# Altium project multimeter.prjpcb
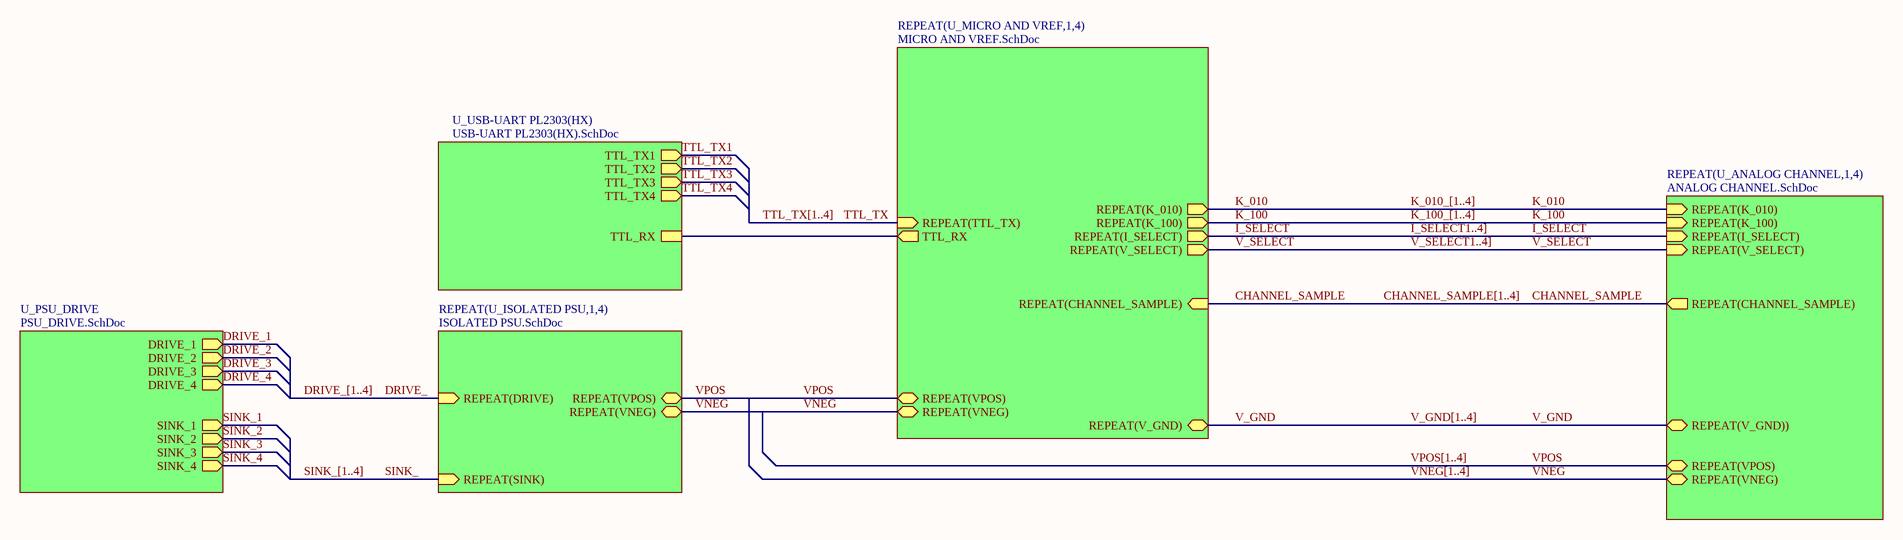
[diagram p0: Multi2Meter.SchDoc]
4 sheets, 212 parts. Net scope: hierarchical (ports join the sheet entries above them; power ports are global).
Board files: m2m v00.PcbDoc, m2m V00 End Plate 00.PcbDoc, m2m V00 End Plate 01.PcbDoc, SEEED ORDER METER (BOOTSTRAP).PcbDoc
Sheets:
  Multi2Meter.SchDoc
    U_ANALOG CHANNEL1 = ANALOG CHANNEL.SchDoc
    U_ANALOG CHANNEL2 = ANALOG CHANNEL.SchDoc
    U_ANALOG CHANNEL3 = ANALOG CHANNEL.SchDoc
    U_ANALOG CHANNEL4 = ANALOG CHANNEL.SchDoc
    U_MICRO AND VREF1 = MICRO AND VREF.SchDoc
    U_MICRO AND VREF2 = MICRO AND VREF.SchDoc
    U_MICRO AND VREF3 = MICRO AND VREF.SchDoc
    U_MICRO AND VREF4 = MICRO AND VREF.SchDoc
    U_ISOLATED PSU1 = ISOLATED PSU.SchDoc
    U_ISOLATED PSU2 = ISOLATED PSU.SchDoc
    U_ISOLATED PSU3 = ISOLATED PSU.SchDoc
    U_ISOLATED PSU4 = ISOLATED PSU.SchDoc

## Sheet Multi2Meter.SchDoc
size A3

### Sub-sheets
REPEAT(U_ANALOG CHANNEL,1,4) = ANALOG CHANNEL.SchDoc: REPEAT(K_010) (in), REPEAT(K_100) (in), REPEAT(I_SELECT) (in), REPEAT(V_SELECT) (in), REPEAT(CHANNEL_SAMPLE) (out), REPEAT(V_GND)) (bidir), REPEAT(VPOS) (bidir), REPEAT(VNEG) (bidir)
REPEAT(U_ISOLATED PSU,1,4) = ISOLATED PSU.SchDoc: REPEAT(DRIVE) (in), REPEAT(SINK) (in), REPEAT(VPOS) (bidir), REPEAT(VNEG) (bidir)
REPEAT(U_MICRO AND VREF,1,4) = MICRO AND VREF.SchDoc: REPEAT(TTL_TX) (in), TTL_RX, REPEAT(K_010) (out), REPEAT(K_100) (out), REPEAT(I_SELECT) (out), REPEAT(V_SELECT) (out), REPEAT(CHANNEL_SAMPLE) (in), REPEAT(V_GND) (bidir), REPEAT(VPOS) (bidir), REPEAT(VNEG) (bidir)
U_PSU_DRIVE = PSU_DRIVE.SchDoc (file not in this document): DRIVE_1 (out), SINK_1 (out), DRIVE_2 (out), SINK_2 (out), DRIVE_3 (out), SINK_3 (out), DRIVE_4 (out), SINK_4 (out)
U_USB-UART PL2303(HX) = USB-UART PL2303(HX).SchDoc (file not in this document): TTL_TX1 (out), TTL_TX2 (out), TTL_TX3 (out), TTL_TX4 (out), TTL_RX

### Nets
CHANNEL_SAMPLE: sheet REPEAT(U_ANALOG CHANNEL,1,4)/REPEAT(CHANNEL_SAMPLE), sheet REPEAT(U_MICRO AND VREF,1,4)/REPEAT(CHANNEL_SAMPLE)
DRIVE_: sheet REPEAT(U_ISOLATED PSU,1,4)/REPEAT(DRIVE)
I_SELECT: sheet REPEAT(U_ANALOG CHANNEL,1,4)/REPEAT(I_SELECT), sheet REPEAT(U_MICRO AND VREF,1,4)/REPEAT(I_SELECT)
K_010: sheet REPEAT(U_ANALOG CHANNEL,1,4)/REPEAT(K_010), sheet REPEAT(U_MICRO AND VREF,1,4)/REPEAT(K_010)
K_100: sheet REPEAT(U_ANALOG CHANNEL,1,4)/REPEAT(K_100), sheet REPEAT(U_MICRO AND VREF,1,4)/REPEAT(K_100)
SINK_: sheet REPEAT(U_ISOLATED PSU,1,4)/REPEAT(SINK)
TTL_TX: sheet REPEAT(U_MICRO AND VREF,1,4)/REPEAT(TTL_TX)
V_GND: sheet REPEAT(U_ANALOG CHANNEL,1,4)/REPEAT(V_GND)), sheet REPEAT(U_MICRO AND VREF,1,4)/REPEAT(V_GND)
V_SELECT: sheet REPEAT(U_ANALOG CHANNEL,1,4)/REPEAT(V_SELECT), sheet REPEAT(U_MICRO AND VREF,1,4)/REPEAT(V_SELECT)
VNEG: sheet REPEAT(U_ANALOG CHANNEL,1,4)/REPEAT(VNEG), sheet REPEAT(U_MICRO AND VREF,1,4)/REPEAT(VNEG), sheet REPEAT(U_ISOLATED PSU,1,4)/REPEAT(VNEG)
VPOS: sheet REPEAT(U_ANALOG CHANNEL,1,4)/REPEAT(VPOS), sheet REPEAT(U_MICRO AND VREF,1,4)/REPEAT(VPOS), sheet REPEAT(U_ISOLATED PSU,1,4)/REPEAT(VPOS)
NetR21A_2: sheet REPEAT(U_MICRO AND VREF,1,4)/TTL_RX, sheet U_USB-UART PL2303(HX)/TTL_RX

### Buses and harness runs
bus CHANNEL_SAMPLE[1..4]
bus DRIVE_[1..4]
bus I_SELECT1..4]
bus K_010_[1..4]
bus K_100_[1..4]
bus SINK_[1..4]
bus TTL_TX[1..4]
bus V_GND[1..4]
bus V_SELECT1..4]
bus VNEG[1..4]
bus VPOS[1..4]

## Sheet ANALOG CHANNEL.SchDoc
size A4; DrawnBy: SML; Revision: 0; SheetNumber: 2; Title2: Title2
Used 4 times, as channels U_ANALOG CHANNEL1, U_ANALOG CHANNEL2, U_ANALOG CHANNEL3, U_ANALOG CHANNEL4. Parts and nets are listed once, with the designators drawn on the sheet.
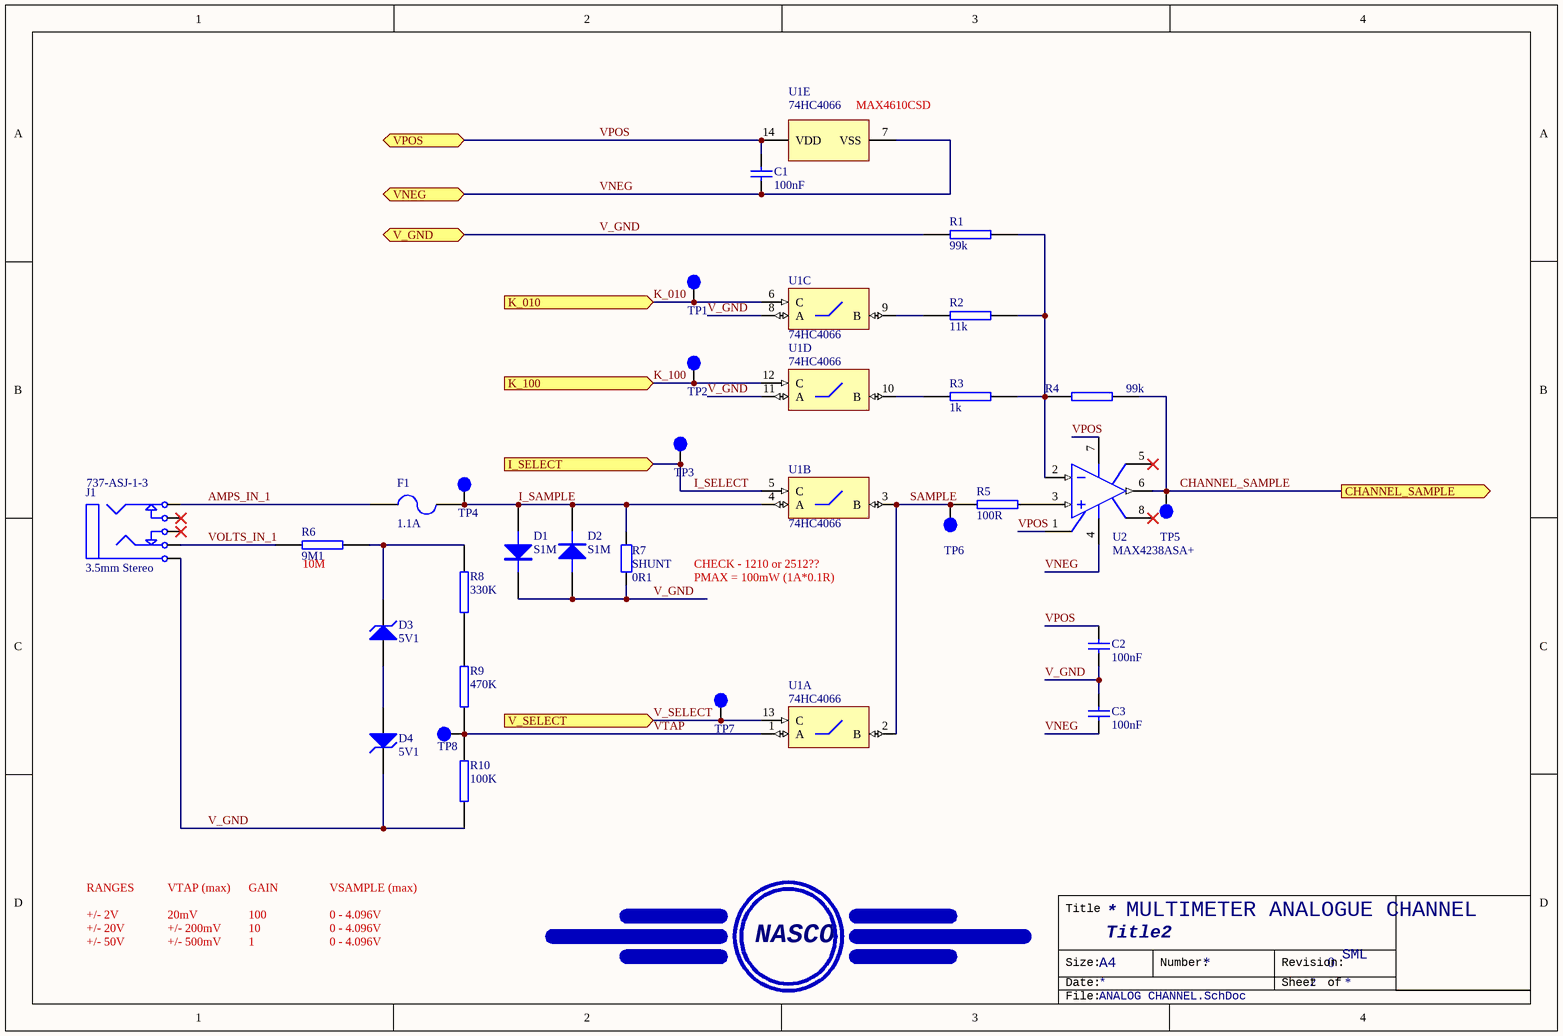
[diagram p1: ANALOG CHANNEL.SchDoc]

### Parts
?  (no value)  (no BOM)
C1  100nF  [CAP (3D) - 0603]
C2  100nF  [CAP (3D) - 0603]
C3  100nF  [CAP (3D) - 0603]
D1  S1M  [DO-214AC]
D2  S1M  [DO-214AC]
D3  5V1  [SOT23-3L]
D4  5V1  [SOT23-3L]
F1  1.1A  [LITTELFUSE 1210]
J1  3.5mm Stereo  Supplier Part Number 1: 737-ASJ-1-3  [3.5MM pcb mouNt]
R1  99k  [RES (3D) - 0603]
R2  11k  [RES (3D) - 0603]
R3  1k  [RES (3D) - 0603]
R4  99k  [RES (3D) - 0603]
R5  100R  [RES (3D) - 0603]
R6  9M1  [RES (3D) - 0603]
R7  SHUNT  value 0R1  [RES (3D) - 1210]
R8  330K  [RES (3D) - 0603]
R9  470K  [RES (3D) - 0603]
R10  100K  [RES (3D) - 0603]
TP1  TestPoint  [TP]  (value not drawn)
TP2  TestPoint  [TP]  (value not drawn)
TP3  TestPoint  [TP]  (value not drawn)
TP4  TestPoint  [TP]  (value not drawn)
TP5  TestPoint  [TP]  (value not drawn)
TP6  TestPoint  [TP]  (value not drawn)
TP7  TestPoint  [TP]  (value not drawn)
TP8  TestPoint  [TP]  (value not drawn)
U1  74HC4066  [DIP-16]  (parts A,B,C,D,E of 5)
U2  MAX4238ASA+  [SO-8]

### Ports
CHANNEL_SAMPLE (out), I_SELECT (in), K_010 (in), K_100 (in), V_GND (bidir), V_SELECT (in), VNEG (bidir), VPOS (bidir)

### Nets
AMPS_IN_1: F1.1 J1.5
CHANNEL_SAMPLE: R4.2 TP5.1 U2.6(OUT) ; port CHANNEL_SAMPLE
I_SAMPLE: D1.1(A) D2.2(K) F1.2 R7.2 TP4.1 U1.4(A)
I_SELECT: TP3.1 U1.5(C) ; port I_SELECT
K_010: TP1.1 U1.6(C) ; port K_010
K_100: TP2.1 U1.12(C) ; port K_100
SAMPLE: R5.1 TP6.1 U1.2(B) U1.3(B)
V_GND: C2.1 C3.2 D1.2(K) D2.1(A) D4.2(K) J1.1 R1.1 R7.1 R10.2 U1.8(A) U1.11(A) ; port V_GND
V_SELECT: TP7.1 U1.13(C) ; port V_SELECT
VNEG: C1.1 C3.1 U1.7(VSS) U2.4(VEE) ; port VNEG
VOLTS_IN_1: J1.2 R6.1
VPOS: C1.2 C2.2 U1.14(VDD) U2.1(NULL) U2.7(VCC) ; port VPOS
VTAP: R9.2 R10.1 TP8.1 U1.1(A)
NetD3_1: D3.1(A) D4.1(A)
NetD3_2: D3.2(K) R6.2 R8.1
NetR1_2: R1.2 R2.2 R3.2 R4.1 U2.2(IN-)
NetR2_1: R2.1 U1.9(B)
NetR3_1: R3.1 U1.10(B)
NetR5_2: R5.2 U2.3(IN+)
NetR8_2: R8.2 R9.1

Not connected (* = marked no-connect by the designer): J1 3* 4*; U2 5(NULL)* 8(NC)*

### Channels
U_ANALOG CHANNEL1: designators end in A; ports CHANNEL_SAMPLE=CHANNEL_SAMPLE I_SELECT=I_SELECT K_010=K_010 K_100=K_100 V_GND=V_GND_U_ANALOG CHANNEL1 V_SELECT=V_SELECT VNEG=VNEG VPOS=VPOS
U_ANALOG CHANNEL2: designators end in B; ports CHANNEL_SAMPLE=CHANNEL_SAMPLE I_SELECT=I_SELECT K_010=K_010 K_100=K_100 V_GND=V_GND_U_ANALOG CHANNEL2 V_SELECT=V_SELECT VNEG=VNEG VPOS=VPOS
U_ANALOG CHANNEL3: designators end in C; ports CHANNEL_SAMPLE=CHANNEL_SAMPLE I_SELECT=I_SELECT K_010=K_010 K_100=K_100 V_GND=V_GND_U_ANALOG CHANNEL3 V_SELECT=V_SELECT VNEG=VNEG VPOS=VPOS
U_ANALOG CHANNEL4: designators end in D; ports CHANNEL_SAMPLE=CHANNEL_SAMPLE I_SELECT=I_SELECT K_010=K_010 K_100=K_100 V_GND=V_GND_U_ANALOG CHANNEL4 V_SELECT=V_SELECT VNEG=VNEG VPOS=VPOS

### Notes on the sheet
- (near U1) MAX4610CSD
- (near R6) 10M
- CHECK - 1210 or 2512??
- PMAX = 100mW (1A*0.1R)
- RANGES
- +/- 2V
- VTAP (max)
- 20mV
- GAIN
- 100
- VSAMPLE (max)
- 0 - 4.096V
- MULTIMETER ANALOGUE CHANNEL
- +/- 20V
- +/- 50V
- +/- 200mV
- +/- 500mV
- 10
- 1
- Title
- NASCO
- Size:
- Date:
- A4
- Number:
- Revision:
- Sheet
- of
- File:

### Library data of the parts
? = NASCO_LOGO: LOGO
C1-C3 = Cap: Capacitor; Value: 100nF; Supplier 1: Mouser; Supplier 2: Digi-Key; Supplier Part Number 1: 603-C0603ZRY5V9BB104; Supplier Part Number 2: 311-1343-2-ND
D1 D2 = DIODE: DIODE, POWER; Manufacturer: TAIWAN SEMI; Mouser Part no.: 821-S1M; Manufacturer Part No.: S1M; value: S1M; Web link: http://au.mouser.com/ProductDetail/Taiwan-Semiconductor/S1M/?qs=sGAEpiMZZMtEwUVCuofpuOlSmRjzJonf%252bmrIm0%252bGbjE%3d
D3 D4 = D Zener: Zener Diode; pin to pad: 2>3; Value: 5V1; Supplier 1: Mouser; Supplier Part Number 1: 625-BZX84C5V1-V; Supplier 2: Digi-Key; Supplier Part Number 2: BZX84C5V1-V-GS08CT-ND
F1 = Fuse 2: Fuse; Manufacturer: Littlefuse; Manufacturer Part No.: 1206L110THYR; Revision: July-2002: Re-released for DXP Platform.; Mouser Part No.: 576-1206L110THYR; Value: 1.1A; Web link: http://au.mouser.com/ProductDetail/Littelfuse/1206L110THYR/?qs=sGAEpiMZZMu7EFbsM1w0ne5Dyqsx7igC3NaPmo8Qtk8%3d
J1 = Phonejack Stereo SW: 3-Conductor Jack with 2 break contacts (normals) and 2 auxiliary make contacts; Altronics Part no.: P0073; Manufacturer: Neutrik; Manufacturer Part No.: NMJ6HFD2; Mouser Part no.: 550-20301; Web link: http://au.mouser.com/ProductDetail/Neutrik/NMJ6HFD2/?qs=y5MlCMoPWsng3r9W7xlRqw%3d%3d; Supplier 1: Mouser
R1-R5 = RES SMD 0603: RESISTOR SMD 0603
  R1 R4: value: 99k
  R2: value: 11k
  R3: value: 1k
  R5: value: 100R
R6 = RES SMD 0603 10k: RESISTOR SMD 0603 10k; Manufacturer: Vishay/Dale; Manufacturer Part No.: CRCW06038M06FKEA; Mouser Part no.: 71-CRCW0603-8.06M-E3; Web link: http://au.mouser.com/ProductDetail/Vishay/CRCW06038M06FKEA/?qs=y%252bMD5VLd6nuCUjzPeM%2fNuA%3d%3d; value: 9M1
R7 = Res2: Resistor; Published: 8-Jun-2000; LatestRevisionDate: 17-Jul-2002; LatestRevisionNote: Re-released for DXP Platform.; PackageReference: AXIAL-0.4; Publisher: Altium Limited; PackageDescription: Axial Device, Thru-Hole; 2 Leads; 0.4 in Pin Spacing
R8-R10 = RES SMD 0603 10k: RESISTOR SMD 0603 10k
  R8: value: 330K
  R9: value: 470K
  R10: value: 100K
U1 = 74HC4066: Quadruple Bilateral Analog Switch
U2 = MAX495CSA: Single Voltage-Feedback Operational Amplifier; Published: 23-Sep-2002; LatestRevisionDate: 13-Apr-2006; LatestRevisionNote: IPC-7351 Footprint Added.; DatasheetVersion: Rev 2; 9/96; PackageReference: NSO8; Publisher: Altium Limited; PackageDescription: 8-Pin Small Outline Integrated Circuit 1.27 mm Pitch; Code_JEDEC: MS-012-AA; Code_IPC: SOIC127P600-8; ComponentLink1Description: Manufacturer Link; ComponentLink1URL: http://www.maxim-ic.com/; ComponentLink2Description: Datasheet; ComponentLink2URL: http://pdfserv.maxim-ic.com/en/ds/MAX492-MAX495.pdf

## Sheet MICRO AND VREF.SchDoc
size A4
Used 4 times, as channels U_MICRO AND VREF1, U_MICRO AND VREF2, U_MICRO AND VREF3, U_MICRO AND VREF4. Parts and nets are listed once, with the designators drawn on the sheet.
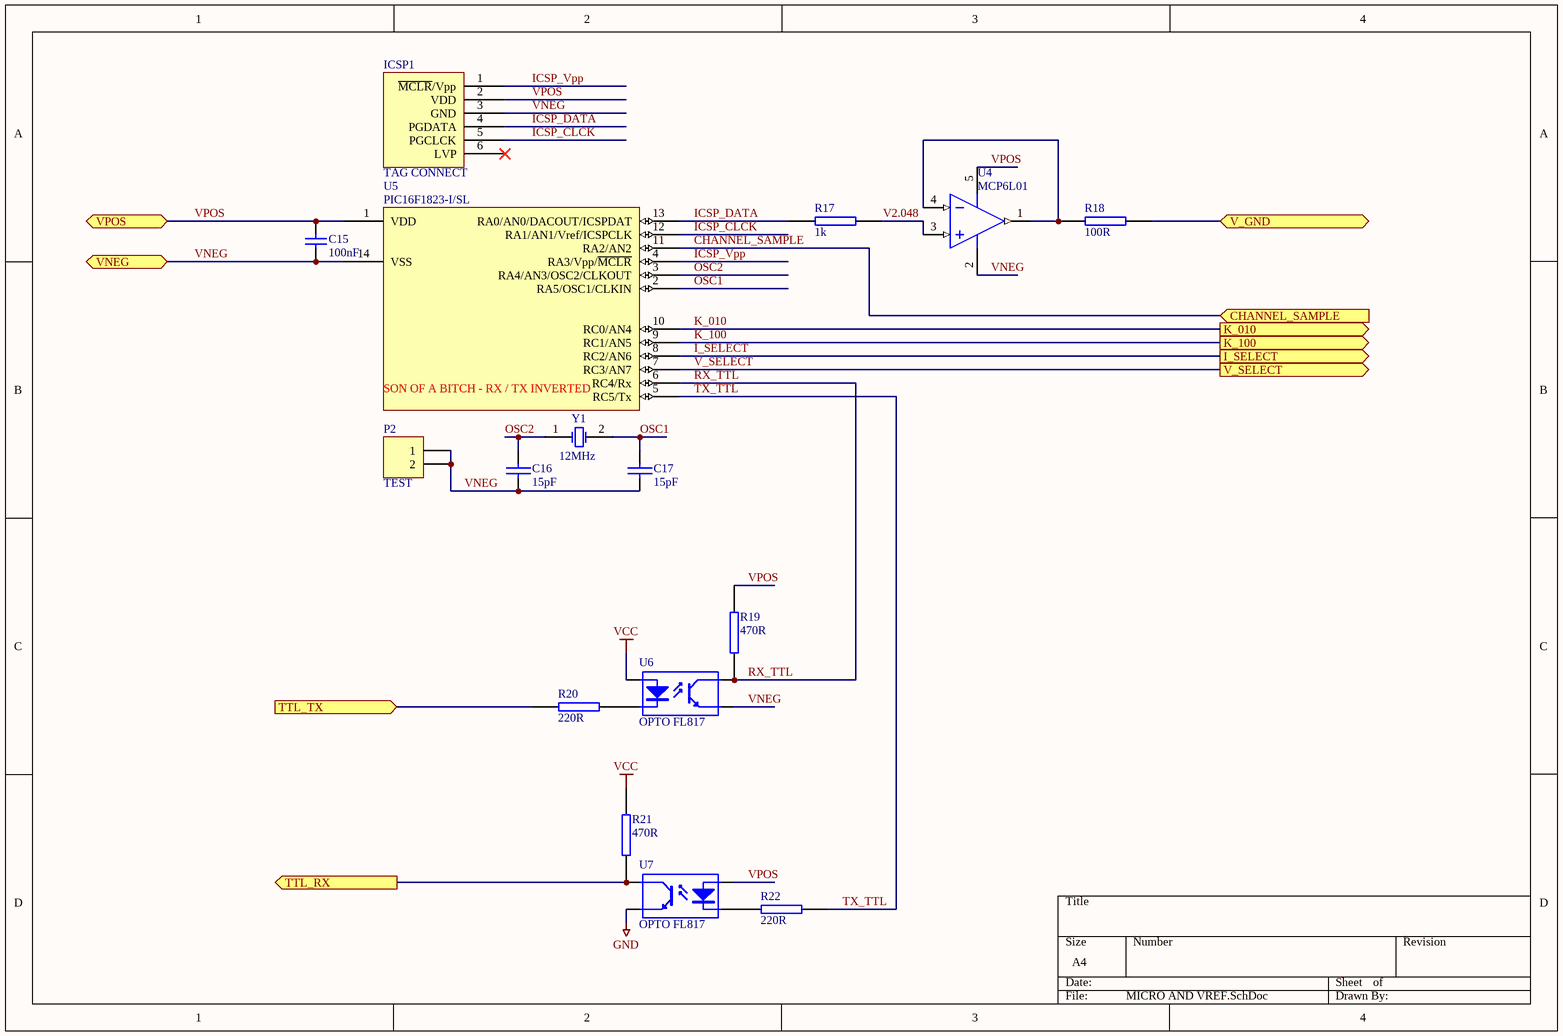
[diagram p2: MICRO AND VREF.SchDoc]

### Parts
C15  100nF  [CAP (3D) - 0603]
C16  15pF  [CAP (3D) - 0603]
C17  15pF  [CAP (3D) - 0603]
ICSP1  TAG CONNECT  [ICSP - TAG CONNECT TYPE2]
P2  TEST  [HDR1X2]
R17  1k  [RES (3D) - 0603]
R18  100R  [RES (3D) - 0603]
R19  470R  [RES (3D) - 0603]
R20  220R  [RES (3D) - 0603]
R21  470R  [RES (3D) - 0603]
R22  220R  [RES (3D) - 0603]
U4  MCP6L01  [SOT23-5AL]
U5  PIC16F1823-I/SL  [SOIC-14]
U6  OPTO FL817  [DIP_4]
U7  OPTO FL817  [DIP_4]
Y1  value 12MHz  [CRYSTAL 3x8]  (hidden comment: XTAL)

### Ports
CHANNEL_SAMPLE (in), I_SELECT (out), K_010 (out), K_100 (out), TTL_RX, TTL_TX (in), V_GND (bidir), V_SELECT (out), VNEG (bidir), VPOS (bidir)

### Nets
GND: U7.3(E)
VCC: R21.1 U6.1(A)
CHANNEL_SAMPLE: U5.11(RA2/AN2) ; port CHANNEL_SAMPLE
I_SELECT: U5.8(RC2/AN6) ; port I_SELECT
ICSP_CLCK: ICSP1.5(PGCLCK) U5.12(RA1/AN1/Vref/ICSPCLK)
ICSP_DATA: ICSP1.4(PGDATA) R17.2 U5.13(RA0/AN0/DACOUT/ICSPDAT)
ICSP_Vpp: ICSP1.1(~{MCLR}/Vpp) U5.4(RA3/Vpp/~{MCLR})
K_010: U5.10(RC0/AN4) ; port K_010
K_100: U5.9(RC1/AN5) ; port K_100
OSC1: C17.1 U5.2(RA5/OSC1/CLKIN) Y1.2(OSC2)
OSC2: C16.1 U5.3(RA4/AN3/OSC2/CLKOUT) Y1.1(OSC1)
RX_TTL: R19.2 U5.6(RC4/Rx) U6.4(C)
TTL_RX: R21.2 U7.4(C) ; port TTL_RX
TTL_TX: R20.1 ; port TTL_TX
TX_TTL: R22.2 U5.5(RC5/Tx)
V2.048: R17.1 U4.3(INA+)
V_GND: R18.2 ; port V_GND
V_SELECT: U5.7(RC3/AN7) ; port V_SELECT
VNEG: C15.1 C16.2 C17.2 ICSP1.3(GND) P2.1 P2.2 U4.2(GND) U5.14(VSS) U6.3(E) ; port VNEG
VPOS: C15.2 ICSP1.2(VDD) R19.1 U4.5(V+) U5.1(VDD) U7.1(A) ; port VPOS
NetR18_1: R18.1 U4.1(OUTA) U4.4(INA-)
NetR20_2: R20.2 U6.2(K)
NetR22_1: R22.1 U7.2(K)

Not connected (* = marked no-connect by the designer): ICSP1 6(LVP)*

### Channels
U_MICRO AND VREF1: designators end in A; ports CHANNEL_SAMPLE=CHANNEL_SAMPLE I_SELECT=I_SELECT K_010=K_010 K_100=K_100 TTL_RX=NetR21A_2 TTL_TX=TTL_TX1 V_GND=V_GND1 V_SELECT=V_SELECT VNEG=VNEG VPOS=VPOS
U_MICRO AND VREF2: designators end in B; ports CHANNEL_SAMPLE=CHANNEL_SAMPLE I_SELECT=I_SELECT K_010=K_010 K_100=K_100 TTL_RX=NetR21A_2 TTL_TX=TTL_TX2 V_GND=V_GND2 V_SELECT=V_SELECT VNEG=VNEG VPOS=VPOS
U_MICRO AND VREF3: designators end in C; ports CHANNEL_SAMPLE=CHANNEL_SAMPLE I_SELECT=I_SELECT K_010=K_010 K_100=K_100 TTL_RX=NetR21A_2 TTL_TX=TTL_TX3 V_GND=V_GND3 V_SELECT=V_SELECT VNEG=VNEG VPOS=VPOS
U_MICRO AND VREF4: designators end in D; ports CHANNEL_SAMPLE=CHANNEL_SAMPLE I_SELECT=I_SELECT K_010=K_010 K_100=K_100 TTL_RX=NetR21A_2 TTL_TX=TTL_TX4 V_GND=V_GND4 V_SELECT=V_SELECT VNEG=VNEG VPOS=VPOS

### Notes on the sheet
- (near U5) SON OF A BITCH - RX / TX INVERTED

### Library data of the parts
C15 = Cap: Capacitor; Value: 100nF; Supplier 1: Mouser; Supplier 2: Digi-Key; Supplier Part Number 1: 603-C0603ZRY5V9BB104; Supplier Part Number 2: 311-1343-2-ND
C16 C17 = CAP: CAPACITOR SMD 0402; Manufacturer: Xicon; Manufacturer Part No.: 140-CC504N150J-RC; value: 15pF; Mouser Part no.: 140-CC504N150J-RC; Web link: http://au.mouser.com/ProductDetail/Xicon/140-CC504N150J-RC/?qs=0ZUpllj3bsY%252bl3b%252btrhy8ZRrWnFRAos3
ICSP1 = ICSP - TAG CONNECT: Manufacturer: N/A - PCB ARTWORK; Manufacturer Part No.: N/A; Mouser Part no.: N/A; Web link: N/A - PCB ARTWORK
P2 = Header 2: Header, 2-Pin; Manufacturer: Bourns; Manufacturer Part No.: CR0603-FX-5900ELF; value: 590R; Mouser Part no.: 652-CR0603FX-5900ELF; Web link: http://au.mouser.com/Search/Refine.aspx?Keyword=652-CR0603FX-5900ELF
R17 R20 R22 = RES SMD 0603 1k: RESISTOR SMD 0603 1k
  R17: value: 1k
  R20 R22: value: 220R
R18 = RES SMD 0603: RESISTOR SMD 0603; value: 100R
R19 R21 = RES SMD 0603 100R: RESISTOR SMD 0603; Value: 470R
U5 = PIC16F1823: Web Link: http://au.mouser.com/ProductDetail/Microchip-Technology/PIC16F1823-I-SL/?qs=sGAEpiMZZMvqv2n3s2xjsW2MXUmlRZqtARQgJEn43Ss%3d
U6 U7 = FL817: 4-Pin Phototransistor Optocoupler
Y1 = XTAL: Crystal Oscillator; Web link: http://au.mouser.com/ProductDetail/ECS/ECS-160-20-5PX-TR/?qs=CkbNAJEAr%2fRSmE52Hssuc4XnCMYWVt7B
U4 = MCP6L01: Value: MCP6L01

## Sheet ISOLATED PSU.SchDoc
size A4
Used 4 times, as channels U_ISOLATED PSU1, U_ISOLATED PSU2, U_ISOLATED PSU3, U_ISOLATED PSU4. Parts and nets are listed once, with the designators drawn on the sheet.
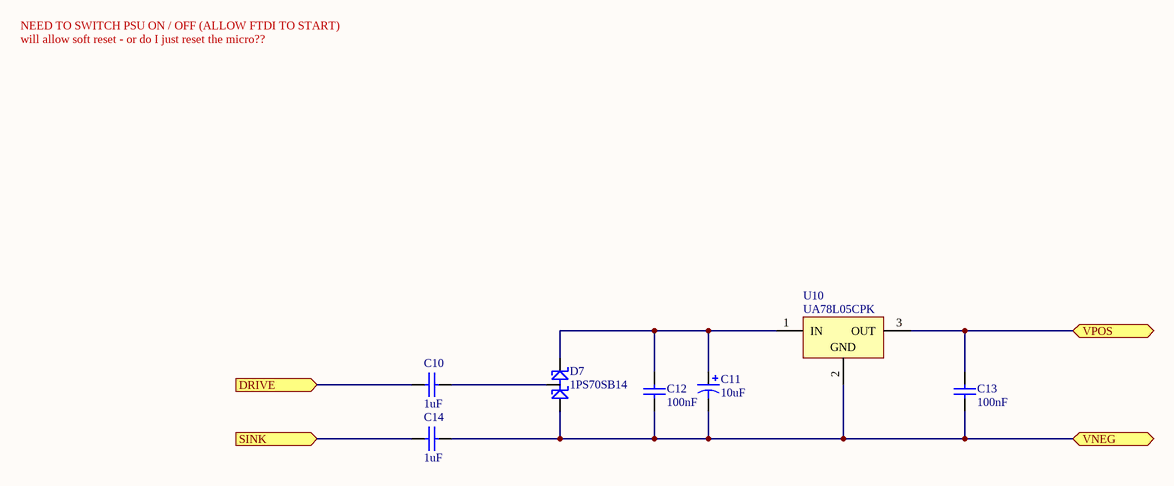
[diagram p3: ISOLATED PSU.SchDoc]

### Parts
C10  1uF  [RES (3D) - 1210]
C11  10uF  [CAP ELECTRO SIZE-B]
C12  100nF  [CAP (3D) - 0603]
C13  100nF  [CAP (3D) - 0603]
C14  1uF  [RES (3D) - 1210]
D7  1PS70SB14  [SOT23-3L]
U10  UA78L05CPK  [SOT89]

### Ports
DRIVE (in), SINK (in), VNEG (bidir), VPOS (bidir)

### Nets
DRIVE: C10.1 ; port DRIVE
SINK: C14.1 ; port SINK
VNEG: C11.2 C12.1 C13.1 C14.2 D7.1(A1) U10.2(GND) ; port VNEG
VPOS: C13.2 U10.3(OUT) ; port VPOS
NetC10_2: C10.2 D7.3(C1/A2)
NetC11_1: C11.1 C12.2 D7.2(C2) U10.1(IN)

### Channels
U_ISOLATED PSU1: designators end in A; ports DRIVE=DRIVE_1 SINK=SINK_1 VNEG=VNEG VPOS=VPOS
U_ISOLATED PSU2: designators end in B; ports DRIVE=DRIVE_2 SINK=SINK_2 VNEG=VNEG VPOS=VPOS
U_ISOLATED PSU3: designators end in C; ports DRIVE=DRIVE_3 SINK=SINK_3 VNEG=VNEG VPOS=VPOS
U_ISOLATED PSU4: designators end in D; ports DRIVE=DRIVE_4 SINK=SINK_4 VNEG=VNEG VPOS=VPOS

### Notes on the sheet
- NEED TO SWITCH PSU ON / OFF (ALLOW FTDI TO START)
- will allow soft reset - or do I just reset the micro??

### Library data of the parts
C10 C14 = CAP: CAPACITOR SMD 0603; Manufacturer: Vishay; Manufacturer Part No.: VJ1206V105MXATW1BC; value: 1uF; Mouser Part no.: 77-VJ1206V105MXATBC; Web link: http://au.mouser.com/ProductDetail/Vishay-Vitramon/VJ1206V105MXATW1BC/?qs=sGAEpiMZZMsh%252b1woXyUXj%2f5vVgHgQOtXd6kjM69bn8k%3d
C11 = Cap Pol1: Polarized Capacitor (Radial); Value: 10uF
C12 C13 = Cap: Capacitor; Value: 100nF; Supplier 1: Mouser; Supplier 2: Digi-Key; Supplier Part Number 1: 603-C0603ZRY5V9BB104; Supplier Part Number 2: 311-1343-2-ND
D7 = 1PS70SB14: DUAL DIODE, SCHOTTKY; Manufacturer: NXP SEMICONDUCTORS; Manufacturer Part No.: 1PS70SB14,115; Mouser Part no.: 771-1PS70SB14115; PackageReference: SOT-23; value: 1PS70SB14; Web link: http://au.mouser.com/ProductDetail/NXP/1PS70SB14115/?qs=%2fha2pyFaduilAAyL24tUzZnn4tsMeHrtxaD3Jd8jZKE%3d
U10 = UA78L05CPK: 3-Terminal Positive Fixed Voltage Regulator; Manufacturer: Texas Instruments; Value: 78L05; Mouser Part No.: 595-UA78L05CPK; Manufacturer Part No.: UA78L05CPK; Web link: http://au.mouser.com/ProductDetail/Texas-Instruments/UA78L05CPK/?qs=sGAEpiMZZMug9GoBKXZ752zpfzgkUxVv6JK8yg2x40A%3d

## Nets that join several sheets
GND: U_MICRO AND VREF1 (U7A.3), U_MICRO AND VREF2 (U7B.3), U_MICRO AND VREF3 (U7C.3), U_MICRO AND VREF4 (U7D.3)
VCC: U_MICRO AND VREF1 (R21A.1 U6A.1), U_MICRO AND VREF2 (R21B.1 U6B.1), U_MICRO AND VREF3 (R21C.1 U6C.1), U_MICRO AND VREF4 (R21D.1 U6D.1)
CHANNEL_SAMPLE: U_ANALOG CHANNEL1 (R4A.2 TP5A.1 U2A.6), U_MICRO AND VREF1 (U5A.11)
CHANNEL_SAMPLE: U_ANALOG CHANNEL2 (R4B.2 TP5B.1 U2B.6), U_MICRO AND VREF2 (U5B.11)
CHANNEL_SAMPLE: U_ANALOG CHANNEL3 (R4C.2 TP5C.1 U2C.6), U_MICRO AND VREF3 (U5C.11)
CHANNEL_SAMPLE: U_ANALOG CHANNEL4 (R4D.2 TP5D.1 U2D.6), U_MICRO AND VREF4 (U5D.11)
I_SELECT: U_ANALOG CHANNEL1 (TP3A.1 U1A.5), U_MICRO AND VREF1 (U5A.8)
I_SELECT: U_ANALOG CHANNEL2 (TP3B.1 U1B.5), U_MICRO AND VREF2 (U5B.8)
I_SELECT: U_ANALOG CHANNEL3 (TP3C.1 U1C.5), U_MICRO AND VREF3 (U5C.8)
I_SELECT: U_ANALOG CHANNEL4 (TP3D.1 U1D.5), U_MICRO AND VREF4 (U5D.8)
K_010: U_ANALOG CHANNEL1 (TP1A.1 U1A.6), U_MICRO AND VREF1 (U5A.10)
K_010: U_ANALOG CHANNEL2 (TP1B.1 U1B.6), U_MICRO AND VREF2 (U5B.10)
K_010: U_ANALOG CHANNEL3 (TP1C.1 U1C.6), U_MICRO AND VREF3 (U5C.10)
K_010: U_ANALOG CHANNEL4 (TP1D.1 U1D.6), U_MICRO AND VREF4 (U5D.10)
K_100: U_ANALOG CHANNEL1 (TP2A.1 U1A.12), U_MICRO AND VREF1 (U5A.9)
K_100: U_ANALOG CHANNEL2 (TP2B.1 U1B.12), U_MICRO AND VREF2 (U5B.9)
K_100: U_ANALOG CHANNEL3 (TP2C.1 U1C.12), U_MICRO AND VREF3 (U5C.9)
K_100: U_ANALOG CHANNEL4 (TP2D.1 U1D.12), U_MICRO AND VREF4 (U5D.9)
NetR21A_2: U_MICRO AND VREF1 (R21A.2 U7A.4), U_MICRO AND VREF2 (R21B.2 U7B.4), U_MICRO AND VREF3 (R21C.2 U7C.4), U_MICRO AND VREF4 (R21D.2 U7D.4)
V_SELECT: U_ANALOG CHANNEL1 (TP7A.1 U1A.13), U_MICRO AND VREF1 (U5A.7)
V_SELECT: U_ANALOG CHANNEL2 (TP7B.1 U1B.13), U_MICRO AND VREF2 (U5B.7)
V_SELECT: U_ANALOG CHANNEL3 (TP7C.1 U1C.13), U_MICRO AND VREF3 (U5C.7)
V_SELECT: U_ANALOG CHANNEL4 (TP7D.1 U1D.13), U_MICRO AND VREF4 (U5D.7)
VNEG: U_ANALOG CHANNEL1 (C1A.1 C3A.1 U1A.7 U2A.4), U_MICRO AND VREF1 (9 pins), U_ISOLATED PSU1 (6 pins)
VNEG: U_ANALOG CHANNEL2 (C1B.1 C3B.1 U1B.7 U2B.4), U_MICRO AND VREF2 (9 pins), U_ISOLATED PSU2 (6 pins)
VNEG: U_ANALOG CHANNEL3 (C1C.1 C3C.1 U1C.7 U2C.4), U_MICRO AND VREF3 (9 pins), U_ISOLATED PSU3 (6 pins)
VNEG: U_ANALOG CHANNEL4 (C1D.1 C3D.1 U1D.7 U2D.4), U_MICRO AND VREF4 (9 pins), U_ISOLATED PSU4 (6 pins)
VPOS: U_ANALOG CHANNEL1 (5 pins), U_MICRO AND VREF1 (6 pins), U_ISOLATED PSU1 (C13A.2 U10A.3)
VPOS: U_ANALOG CHANNEL2 (5 pins), U_MICRO AND VREF2 (6 pins), U_ISOLATED PSU2 (C13B.2 U10B.3)
VPOS: U_ANALOG CHANNEL3 (5 pins), U_MICRO AND VREF3 (6 pins), U_ISOLATED PSU3 (C13C.2 U10C.3)
VPOS: U_ANALOG CHANNEL4 (5 pins), U_MICRO AND VREF4 (6 pins), U_ISOLATED PSU4 (C13D.2 U10D.3)